# Altium schematic sheet 2-MIN-SYSTEM.SchDoc
size A4 portrait
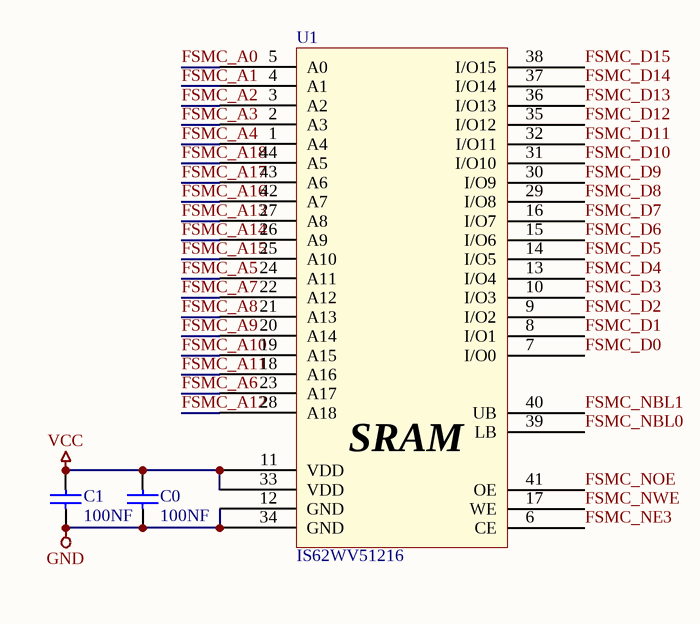
[diagram p0: 2-MIN-SYSTEM.SchDoc]

## Parts
C0  100NF  [CC1608-0603]
C1  100NF  [CC1608-0603]
U1  IS62WV51216  [TSOP44_M]

## Nets
GND: C0.1 C1.1 U1.12(GND) U1.34(GND)
VCC: C0.2 C1.2 U1.11(VDD) U1.33(VDD)
FSMC_A0: U1.5(A0)
FSMC_A1: U1.4(A1)
FSMC_A2: U1.3(A2)
FSMC_A3: U1.2(A3)
FSMC_A4: U1.1(A4)
FSMC_A5: U1.24(A11)
FSMC_A6: U1.23(A17)
FSMC_A7: U1.22(A12)
FSMC_A8: U1.21(A13)
FSMC_A9: U1.20(A14)
FSMC_A10: U1.19(A15)
FSMC_A11: U1.18(A16)
FSMC_A12: U1.28(A18)
FSMC_A13: U1.27(A8)
FSMC_A14: U1.26(A9)
FSMC_A15: U1.25(A10)
FSMC_A16: U1.42(A7)
FSMC_A17: U1.43(A6)
FSMC_A18: U1.44(A5)
FSMC_D0: U1.7(I/O0)
FSMC_D1: U1.8(I/O1)
FSMC_D2: U1.9(I/O2)
FSMC_D3: U1.10(I/O3)
FSMC_D4: U1.13(I/O4)
FSMC_D5: U1.14(I/O5)
FSMC_D6: U1.15(I/O6)
FSMC_D7: U1.16(I/O7)
FSMC_D8: U1.29(I/O8)
FSMC_D9: U1.30(I/O9)
FSMC_D10: U1.31(I/O10)
FSMC_D11: U1.32(I/O11)
FSMC_D12: U1.35(I/O12)
FSMC_D13: U1.36(I/O13)
FSMC_D14: U1.37(I/O14)
FSMC_D15: U1.38(I/O15)
FSMC_NBL0: U1.39(LB)
FSMC_NBL1: U1.40(UB)
FSMC_NE3: U1.6(CE)
FSMC_NOE: U1.41(OE)
FSMC_NWE: U1.17(WE)

## Library data of the parts
C0 C1 = Cap Chip 0603: 电容; Published: 8-Jun-2000; Revision: July-2002: Re-released for DXP Platform.; Publisher: Altium Limited
U1 = IS62WV51216: SRAM